# EAGLE design rotenc (EAGLE 9.6.2)
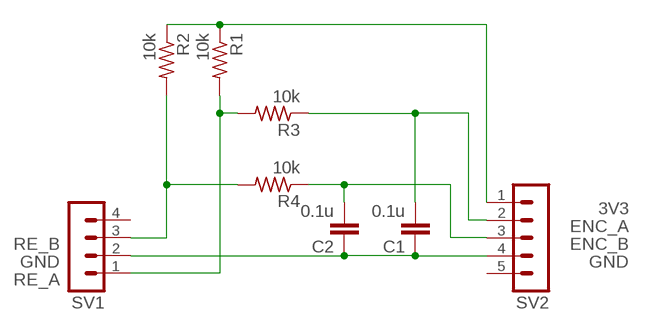
[diagram p0: schematic, sheet 1]

## Parts
C1  0.1u  C-EU025-025X050  [C025-025X050]
C2  0.1u  C-EU025-025X050  [C025-025X050]
R1  10k  R-US_0204/7  [0204/7]
R2  10k  R-US_0204/7  [0204/7]
R3  10k  R-US_0204/7  [0204/7]
R4  10k  R-US_0204/7  [0204/7]
SV1  MA04-1  [MA04-1]
SV2  MA05-1  [MA05-1]

## Nets
3V3: R1.1 R2.1 SV2.1
ENC_A: C1.2 R3.1 SV2.2
ENC_B: C2.2 R4.1 SV2.3
GND: C1.1 C2.1 SV1.2 SV2.4
RE_A: R1.2 R3.2 SV1.1
RE_B: R2.2 R4.2 SV1.3
Unconnected: SV1.4 SV2.5

## Library data of the parts
C1 C2 = rcl:C-EU: CAPACITOR, European symbol; SPICEPREFIX: C
R1-R4 = rcl:R-US_: RESISTOR, American symbol; SPICEPREFIX: R
SV1 = con-lstb:MA04-1: PIN HEADER; OC_FARNELL: unknown; OC_NEWARK: unknown
SV2 = con-lstb:MA05-1: PIN HEADER; OC_FARNELL: unknown; OC_NEWARK: unknown

## Board
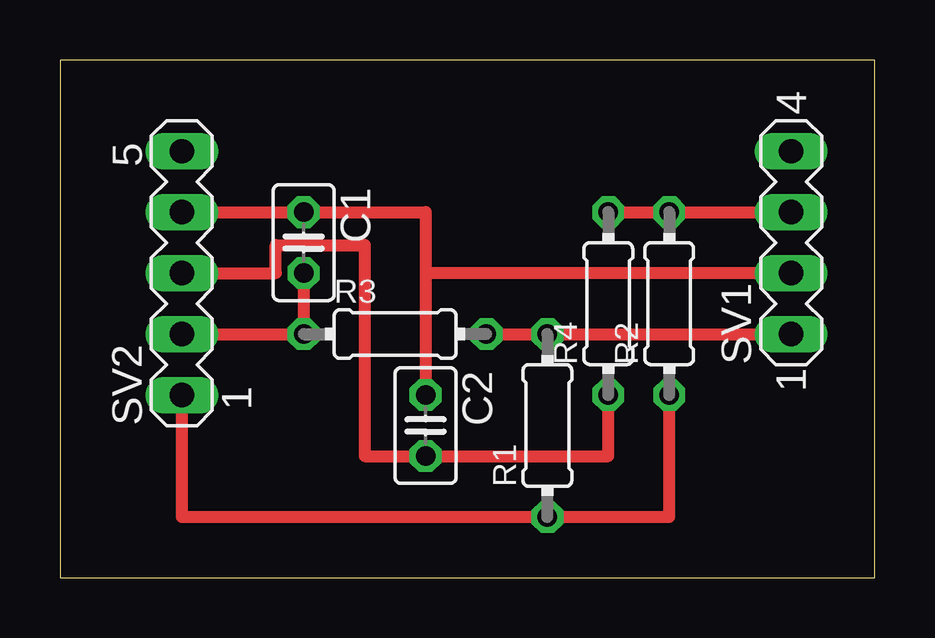
[diagram p1: board, top side]

Size 33.96 x 21.58 mm. Coordinates in mm from the lower left corner, seen from the top.
Outline: 0,0 33.96,0 33.96,21.58 0,21.58 0,0
Copper layers (1*16): Top 0.035mm / dielectric 1.5mm / Bottom 0.035mm
Design rules "default": minimum track width 6mil, minimum drill 0.35mm, track to track 6mil, track to pad 6mil, pad to pad 6mil, via to via 6mil, smd to smd 6mil, copper to edge 40mil, drill to drill 6mil, minimum pad ring 10mil, minimum via ring 8mil, stop-mask expansion 4mil, vias tented up to drill 0mil, thermal gap 10mil

### Footprints (pad centres in the part's own frame; a part is rotated, then mirrored left to right if it is on the bottom)
C025-025X050 = drill 0.813 octagon: 1 -1.27,0; 2 1.27,0
0204/7 = drill 0.813 octagon: 1 -3.81,0; 2 3.81,0
MA04-1 = drill 1.016 long: 1 -3.81,0; 2 -1.27,0; 3 1.27,0; 4 3.81,0
MA05-1 = drill 1.016 long: 1 -5.08,0; 2 -2.54,0; 3 0,0; 4 2.54,0; 5 5.08,0

### Placement (x,y rotation side)
C1  10.16,13.97 270 top
C2  15.24,6.35 270 top
R1  20.32,6.35 90 top
R2  25.4,11.43 90 top
R3  13.97,10.16 0 top
R4  22.86,11.43 90 top
SV1  30.48,13.97 90 top
SV2  5.08,12.7 90 top

### Tracks (layer width: path | path; a pad name or v marks a point on that pad's centre or on a via)
3V3
  Top 0.508: SV2.1 5.08,2.54 R1.1 25.4,2.54 R2.1
ENC_A
  Top 0.508: SV2.2 R3.1 C1.2
ENC_B
  Top 0.508: R4.1 22.86,5.08 C2.2 12.7,5.08 12.7,13.87 8.99,13.87 8.99,12.7 SV2.3
GND
  Top 0.508: SV2.4 C1.1 15.24,15.24 15.24,12.7 | 15.24,12.7 C2.1 | SV1.2 15.24,12.7
RE_A
  Top 0.508: SV1.1 R1.2 R3.2
RE_B
  Top 0.508: SV1.3 R2.2 R4.2